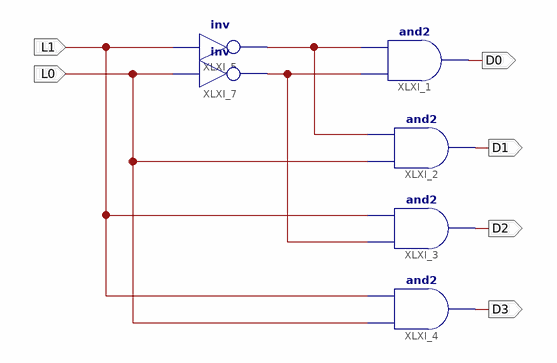
[diagram p0: schematic sheet 1]
// Xilinx ISE schematic Decoder2_4.sch (spartan3e) as structural Verilog: 6 symbols, 6 ports
module Decoder2_4 (
  input  L0,
  input  L1,
  output D0,
  output D1,
  output D2,
  output D3
);

  wire XLXN_7, XLXN_9;

  and XLXI_1 (D0, XLXN_9, XLXN_7);
  and XLXI_2 (D1, L0, XLXN_7);
  and XLXI_3 (D2, XLXN_9, L1);
  and XLXI_4 (D3, L0, L1);
  not XLXI_5 (XLXN_7, L1);
  not XLXI_7 (XLXN_9, L0);
endmodule
